# Altium schematic sheet Sheet1.SchDoc
size A; SheetNumber: 1; SheetTotal: 1
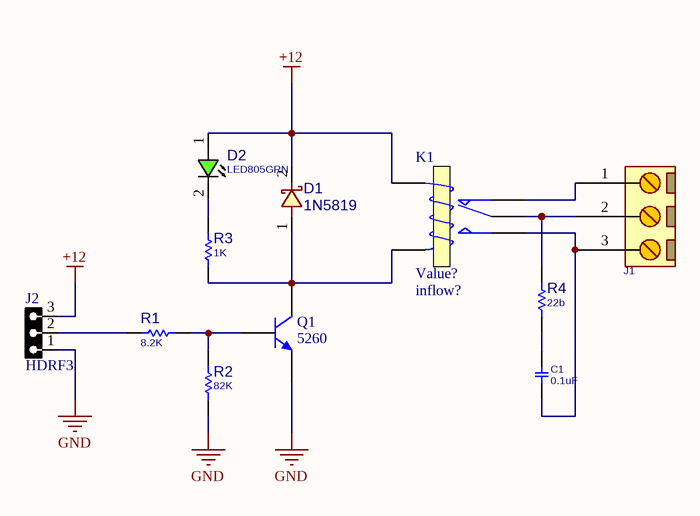
[diagram p0: Sheet1.SchDoc]

## Parts
C1  0.1uF  [C_PLY_13X5]
D1  1N5819  [D_SOD123W]
D2  LED805GRN  [LED0805GRN]
J1  CONN_GMSTB3  [GMSTB762_3]  (value not drawn)
J2  HDRF3  [HDR_F_1X3]
K1  Inflow: inflow?  [Relay 18.85x15.35x15.70]  (hidden comment: Value?)
Q1  Inflow: 5260  [SOT23_N]  (hidden comment: NPN)
R1  8.2K  [R0805]
R2  82K  [R0805]
R3  1K  [R0805]
R4  22b  [R3W_AX09]

## Nets
+12: D1.2 D2.1(ANODE) J2.3 K1.4(T1)
GND: J2.1 Q1.2(E) R2.1
NetC1_1: C1.1 J1.3 K1.3(NO)
NetC1_2: C1.2 R4.1
NetD1_1: D1.1 K1.5(T2) Q1.3(C) R3.1
NetD2_2: D2.2(CATHODE) R3.2
NetJ1_1: J1.1 K1.2(NC)
NetJ1_2: J1.2 K1.1(COM) R4.2
NetJ2_2: J2.2 R1.1
NetQ1_1: Q1.1(B) R1.2 R2.2

## Library data of the parts
C1 = CAP_THD_FILMPLY_10N630V: CAP, FILM, 10nF, 630V; MANF_P#: MANF_PART#; PARAM: 630V; PRICE: 100= 1$; DESC: CAP, FILM,; MANF: MANF; PARAM2: PARAM2; ASSEMBLY: ASSEMBLY; VALUE: 0.1uF
D1 = DIODE_SMD_SCHOTTKY_1N5819: DIODE, SCHOTTKY, 40V, 1A; MANF: DIODES; MANF_P#: 1N5819HW-7-F; DESC: DESCRIPTION; ASSEMBLY: ASSEMBLY; PRICE: PRICE; PARAM2: 1A; PARAM: 40V; VALUE: 1N5819
D2 = LED_SMD_0805_GRN: LED, SMD, 0805, GREEN; PARAM: 20mA; DESC: DESCRIPTION; PARAM2: 2.2V; MANF: -; ASSEMBLY: ASSEMBLY; PRICE: 36t@Javan; MANF_P#: -; VALUE: LED805GRN
J1 = CONN_GMSTB762_3: CONN, PHOENIX MSTB, 5-G, 5.08mm pitch; MANF_P#: GMSTB 2,5/3-G-7,62; VALUE: CONN_GMSTB3
J2 = HDR_F_1X3: CONN, HEADER, Female, pitch: 2.54mm, 3POS; VALUE: HDRF3
K1 = SW_Relay_SPDT: SPDT Relay; Rating: Rating?; Type: SPDT; Package: Dip; Value: Value?
Q1 = Semi_BJT_2N2222_SMD: NPN Switching Transistors; Rating: Rating?; Type: Type?; Value: NPN; Package: Package?
R1-R3 = RES_SMD_0805: RESISTOR, SMD; PARAM: -W; DESC: DESCRIPTION; DIST#: MOUSER; PARAM2: 1%; MANF_P#: -; MANF: -; ASSEMBLY: ASSEMBLY; PRICE: 100= 0.5$
  R1: VALUE: 8.2K
  R2: VALUE: 82K
  R3: VALUE: 1K
R4 = RES_THD: RESISTOR, THD; MANF_P#: RK73H1ETTP4701F; MANF: KOA SPEER; PARAM: 0.063W; DESC: DESCRIPTION; DIST#: MOUSER; PARAM2: 1%; ASSEMBLY: ASSEMBLY; PRICE: 100= 0.5$; VALUE: 22b